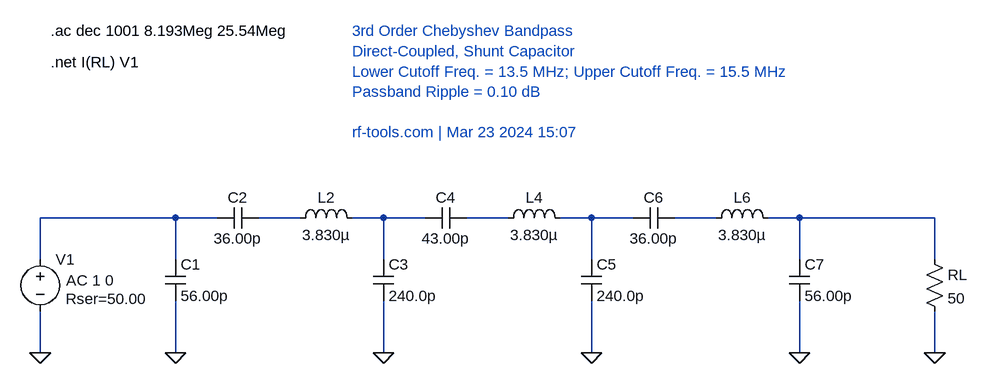
[diagram p0: schematic 20m.asc]
20m.asc, the LTspice schematic file:
Version 4
SHEET 1 1428 400
WIRE 208 0 0 0
WIRE 272 0 208 0
WIRE 400 0 336 0
WIRE 528 0 480 0
WIRE 592 0 528 0
WIRE 720 0 656 0
WIRE 848 0 800 0
WIRE 912 0 848 0
WIRE 1040 0 976 0
WIRE 1168 0 1120 0
WIRE 1376 0 1168 0
WIRE 0 64 0 0
WIRE 208 64 208 0
WIRE 528 64 528 0
WIRE 848 64 848 0
WIRE 1168 64 1168 0
WIRE 1376 64 1376 0
WIRE 0 208 0 144
WIRE 208 208 208 128
WIRE 528 208 528 128
WIRE 848 208 848 128
WIRE 1168 208 1168 128
WIRE 1376 208 1376 144
FLAG 0 208 0
FLAG 208 208 0
FLAG 528 208 0
FLAG 848 208 0
FLAG 1168 208 0
FLAG 1376 208 0
SYMBOL voltage 0 48 R0
WINDOW 123 40 48 Left 2
WINDOW 39 39 77 Left 2
SYMATTR Value2 AC 1 0
SYMATTR SpiceLine Rser=50.00
SYMATTR InstName V1
SYMATTR Value ""
SYMBOL cap 192 64 R0
SYMATTR InstName C1
SYMATTR Value 56.00p
SYMBOL cap 272 16 R270
WINDOW 0 32 32 VTop 2
WINDOW 3 0 32 VBottom 2
SYMATTR InstName C2
SYMATTR Value 36.00p
SYMBOL ind 384 16 R270
WINDOW 0 32 56 VTop 2
WINDOW 3 5 56 VBottom 2
SYMATTR InstName L2
SYMATTR Value 3.830µ
SYMBOL cap 512 64 R0
SYMATTR InstName C3
SYMATTR Value 240.0p
SYMBOL cap 592 16 R270
WINDOW 0 32 32 VTop 2
WINDOW 3 0 32 VBottom 2
SYMATTR InstName C4
SYMATTR Value 43.00p
SYMBOL ind 704 16 R270
WINDOW 0 32 56 VTop 2
WINDOW 3 5 56 VBottom 2
SYMATTR InstName L4
SYMATTR Value 3.830µ
SYMBOL cap 832 64 R0
SYMATTR InstName C5
SYMATTR Value 240.0p
SYMBOL cap 912 16 R270
WINDOW 0 32 32 VTop 2
WINDOW 3 0 32 VBottom 2
SYMATTR InstName C6
SYMATTR Value 36.00p
SYMBOL ind 1024 16 R270
WINDOW 0 32 56 VTop 2
WINDOW 3 5 56 VBottom 2
SYMATTR InstName L6
SYMATTR Value 3.830µ
SYMBOL cap 1152 64 R0
SYMATTR InstName C7
SYMATTR Value 56.00p
SYMBOL res 1360 48 R0
SYMATTR InstName RL
SYMATTR Value 50
TEXT 16 -288 Left 2 !.ac dec 1001 8.193Meg 25.54Meg
TEXT 16 -240 Left 2 !.net I(RL) V1
TEXT 480 -288 Left 2 ;3rd Order Chebyshev Bandpass\nDirect-Coupled, Shunt Capacitor\nLower Cutoff Freq. = 13.5 MHz; Upper Cutoff Freq. = 15.5 MHz\nPassband Ripple = 0.10 dB\n\nrf-tools.com | Mar 23 2024 15:07

The netlist it stands for:
* 20m.asc
V1 N001 0 AC 1 0 Rser=50.00
C1 N001 0 56.00p
C2 N001 N002 36.00p
L2 N002 N003 3.830µ
C3 N003 0 240.0p
C4 N003 N004 43.00p
L4 N004 N005 3.830µ
C5 N005 0 240.0p
C6 N005 N006 36.00p
L6 N006 N007 3.830µ
C7 N007 0 56.00p
RL N007 0 50
.ac dec 1001 8.193Meg 25.54Meg
.net I(RL) V1
* 3rd Order Chebyshev Bandpass
* Direct-Coupled, Shunt Capacitor
* Lower Cutoff Freq. = 13.5 MHz; Upper Cutoff Freq. = 15.5 MHz
* Passband Ripple = 0.10 dB
* rf-tools.com | Mar 23 2024 15:07
.backanno
.end